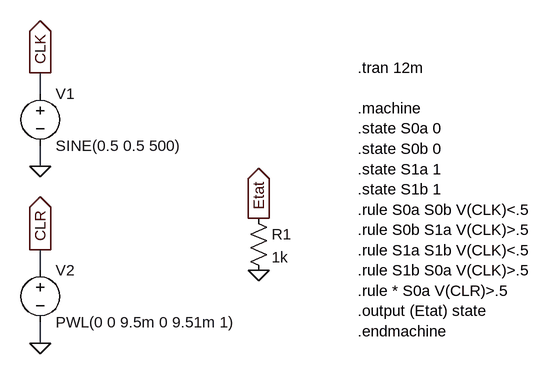
[diagram p0: schematic State Machine.asc]
State Machine.asc, the LTspice schematic file:
Version 4
SHEET 1 880 680
WIRE -192 96 -192 64
WIRE -192 208 -192 176
WIRE -192 368 -192 336
WIRE -192 480 -192 448
FLAG -192 208 0
FLAG -192 64 CLK
IOPIN -192 64 Out
FLAG -192 480 0
FLAG -192 336 CLR
IOPIN -192 336 Out
FLAG 144 368 0
FLAG 144 288 Etat
IOPIN 144 288 Out
SYMBOL voltage -192 80 R0
WINDOW 123 0 0 Left 2
WINDOW 39 0 0 Left 2
SYMATTR InstName V1
SYMATTR Value SINE(0.5 0.5 500)
SYMBOL voltage -192 352 R0
SYMATTR InstName V2
SYMATTR Value PWL(0 0 9.5m 0 9.51m 1)
SYMBOL res 128 272 R0
SYMATTR InstName R1
SYMATTR Value 1k
TEXT 296 56 Left 2 !.tran 12m\n \n.machine\n.state S0a 0\n.state S0b 0\n.state S1a 1\n.state S1b 1\n.rule S0a S0b V(CLK)<.5\n.rule S0b S1a V(CLK)>.5\n.rule S1a S1b V(CLK)<.5\n.rule S1b S0a V(CLK)>.5\n.rule * S0a V(CLR)>.5\n.output (Etat) state\n.endmachine

The netlist it stands for:
* State Machine.asc
V1 CLK 0 SINE(0.5 0.5 500)
V2 CLR 0 PWL(0 0 9.5m 0 9.51m 1)
R1 Etat 0 1k
.tran 12m
.machine
.state S0a 0
.state S0b 0
.state S1a 1
.state S1b 1
.rule S0a S0b V(CLK)<.5
.rule S0b S1a V(CLK)>.5
.rule S1a S1b V(CLK)<.5
.rule S1b S0a V(CLK)>.5
.rule * S0a V(CLR)>.5
.output (Etat) state
.endmachine
.backanno
.end